# EAGLE design reduction (EAGLE 7.7.0)
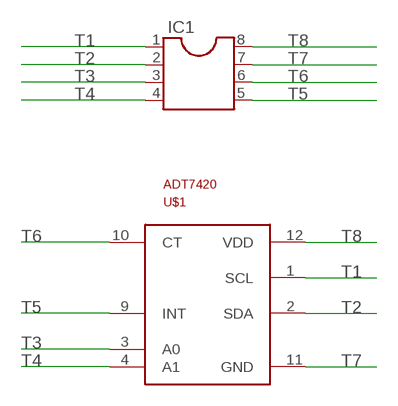
[diagram p0: schematic, sheet 1]

## Parts
IC1  DIL8  [DIL08]
U$1  ADT7420  [LFCSP-16]

## Nets
T1: IC1.1 U$1.1(SCL)
T2: IC1.2 U$1.2(SDA)
T3: IC1.3 U$1.3(A0)
T4: IC1.4 U$1.4(A1)
T5: IC1.5 U$1.9(INT)
T6: IC1.6 U$1.10(CT)
T7: IC1.7 U$1.11(GND)
T8: IC1.8 U$1.12(VDD)

## Library data of the parts
IC1 = ic-package:DIL8: Dual In Line / Socket
U$1 = FM_transmitter:ADT7420

## Board
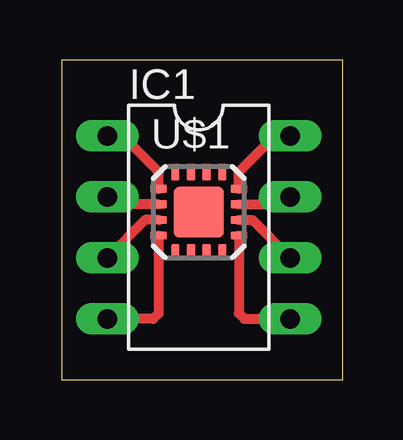
[diagram p1: board, top side]

Size 11.73 x 13.32 mm. Coordinates in mm from the lower left corner, seen from the top.
Outline: 0,0 11.73,0 11.73,13.32 0,13.32 0,0
Copper layers (1*16): Top 0.035mm / dielectric 1.5mm / Bottom 0.035mm
Design rules "default": minimum track width 10mil, minimum drill 24mil, track to track 8mil, track to pad 8mil, pad to pad 8mil, via to via 8mil, smd to smd 8mil, copper to edge 40mil, drill to drill 8mil, minimum pad ring 10mil, minimum via ring 8mil, stop-mask expansion 4mil, vias tented up to drill 0mil, thermal gap 10mil

### Footprints (pad centres in the part's own frame; a part is rotated, then mirrored left to right if it is on the bottom)
DIL08 = drill 0.813 long: 1 -3.81,-3.81; 2 -1.27,-3.81; 3 1.27,-3.81; 4 3.81,-3.81; 5 3.81,3.81; 6 1.27,3.81; 7 -1.27,3.81; 8 -3.81,3.81
LFCSP-16 = smd 0.7 x 0.35: 1 -1.675,0.975; 2 -1.675,0.325; 3 -1.675,-0.325; 4 -1.675,-0.975; 9 1.675,-0.975; 10 1.675,-0.325; 11 1.675,0.325; 12 1.675,0.975 | smd 0.35 x 0.7: 5 -0.975,-1.675; 6 -0.325,-1.675; 7 0.325,-1.675; 8 0.975,-1.675; 13 0.975,1.675; 14 0.325,1.675; 15 -0.325,1.675; 16 -0.975,1.675 | smd 2.1 x 2.1: EXP 0,0

### Placement (x,y rotation side)
IC1  5.71,6.35 270 top
U$1  5.71,6.99 0 top

### Tracks (layer width: path | path; a pad name or v marks a point on that pad's centre or on a via)
T1
  Top 0.406: U$1.1 4.04,8.66 2.54,10.16 IC1.1
T2
  Top 0.406: U$1.2 2.21,7.31 IC1.2
T3
  Top 0.406: U$1.3 3.48,6.66 IC1.3
T4
  Top 0.406: U$1.4 4.04,2.77 3.81,2.54 IC1.4
T5
  Top 0.406: U$1.9 7.39,2.77 7.62,2.54 IC1.5
T6
  Top 0.406: U$1.10 7.95,6.66 IC1.6
T7
  Top 0.406: U$1.11 9.21,7.31 IC1.7
T8
  Top 0.406: U$1.12 7.39,8.66 8.89,10.16 IC1.8